# Altium schematic sheet Top.SchDoc: Top Schematic
size A4; Date: Not used; ApprovedBy: Not used; CheckedBy: Not used; Author: Not used; CompanyName: STMicroelectronics; DrawnBy: Not used; Engineer: Not used; Organization: Not used; Address1: Not used; Address2: Not used; Address3: Not used; Address4: Not used; DocumentNumber: Not used; Revision: Not used; SheetNumber: 2; SheetTotal: 6; CurrentTime: Not used; CurrentDate: Not used; Time: Not used; DocumentFullPathAndName: Not used; DocumentName: Not used; ModifiedDate: Not used; ImagePath: Not used; ProjectName: Not used; Application_BuildNumber: Not used
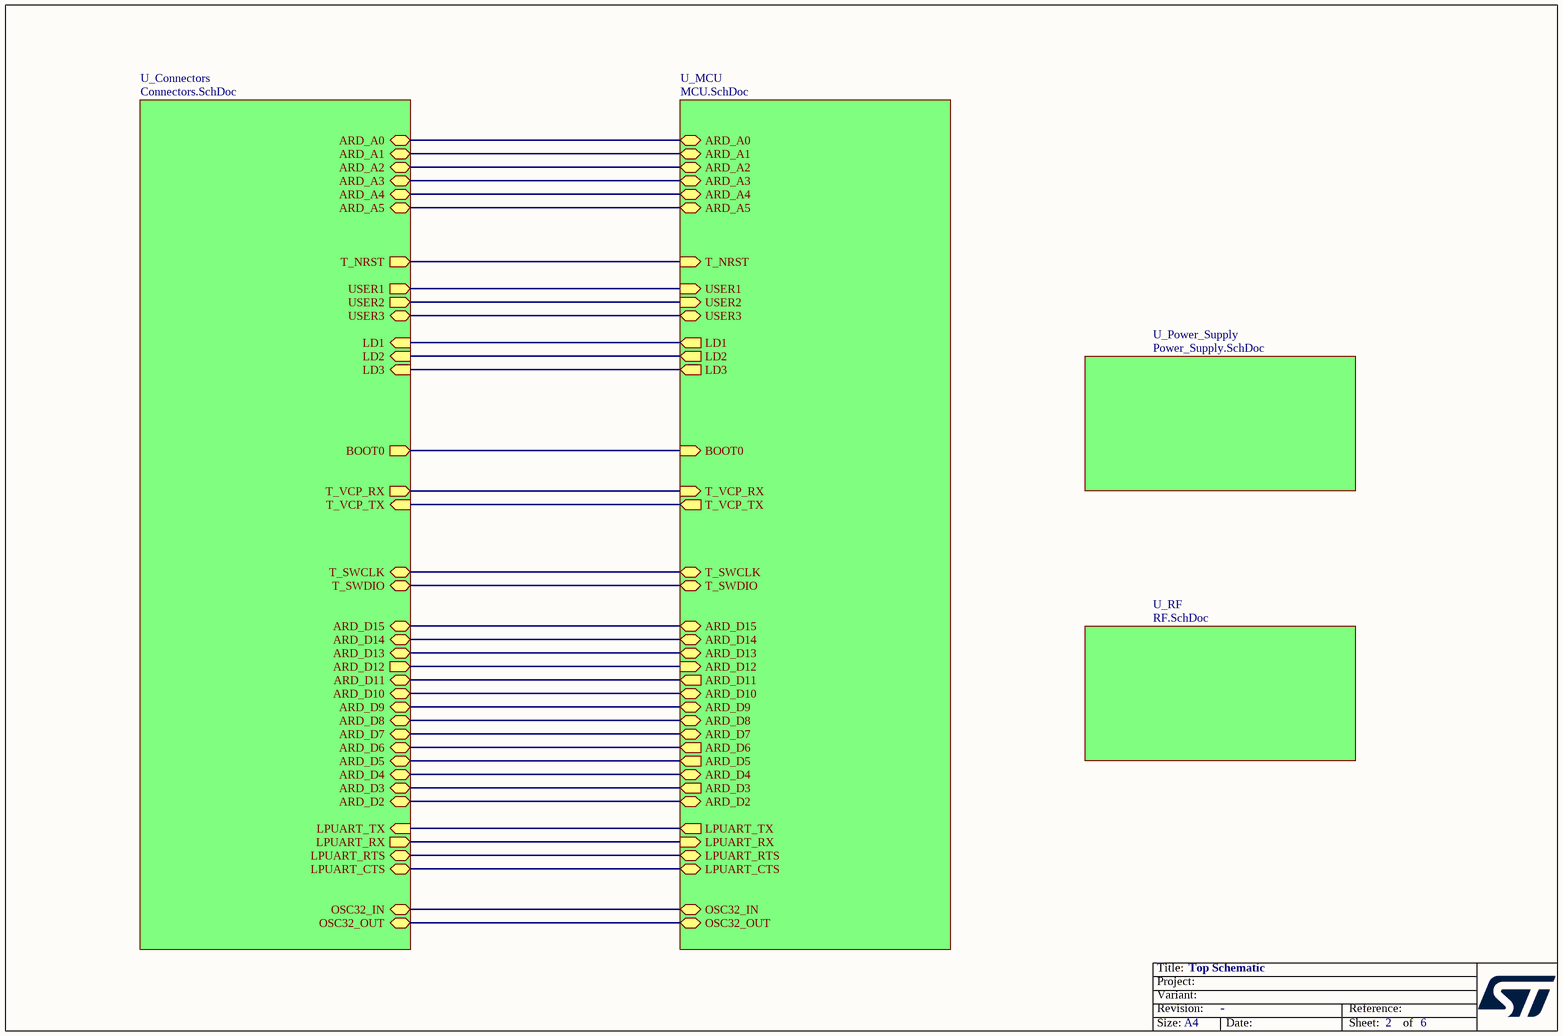
[diagram p0: Top.SchDoc]

## Sub-sheets
U_Connectors = Connectors.SchDoc: LD3 (in), LD1 (in), T_VCP_TX (in), T_SWCLK (bidir), T_SWDIO (bidir), T_VCP_RX (out), T_NRST (out), LD2 (in), OSC32_IN (bidir), OSC32_OUT (bidir), USER2 (out), USER1 (out), BOOT0 (out), ARD_D2 (bidir), USER3 (bidir), ARD_D9 (bidir), ARD_D13 (bidir), ARD_D10 (bidir), ARD_D12 (out), ARD_D14 (bidir), ARD_D15 (bidir), ARD_D11 (bidir), ARD_D8 (bidir), ARD_A1 (bidir), ARD_A0 (bidir), ARD_A2 (bidir), ARD_A3 (bidir), ARD_A4 (bidir), ARD_A5 (bidir), ARD_D7 (bidir), ARD_D6 (bidir), ARD_D3 (bidir), ARD_D4 (bidir), ARD_D5 (bidir), LPUART_TX (in), LPUART_RX (out), LPUART_RTS (bidir), LPUART_CTS (bidir)
U_MCU = MCU.SchDoc: T_NRST (in), LD2 (out), LD3 (out), LD1 (out), T_VCP_RX (in), T_SWCLK (bidir), T_SWDIO (bidir), T_VCP_TX (out), USER2 (in), USER1 (in), OSC32_OUT (bidir), OSC32_IN (bidir), BOOT0 (in), ARD_D2 (bidir), USER3 (bidir), ARD_D9 (bidir), ARD_D14 (bidir), ARD_D15 (bidir), ARD_D8 (bidir), ARD_D12 (in), ARD_D13 (bidir), ARD_A3 (bidir), ARD_A2 (bidir), ARD_A1 (bidir), ARD_A0 (bidir), ARD_A4 (bidir), ARD_A5 (bidir), ARD_D5 (out), ARD_D3 (out), ARD_D6 (out), ARD_D11 (out), ARD_D10 (bidir), ARD_D7 (bidir), ARD_D4 (bidir), LPUART_TX (out), LPUART_RX (in), LPUART_RTS (bidir), LPUART_CTS (bidir)
U_Power_Supply = Power_Supply.SchDoc: no entries
U_RF = RF.SchDoc: no entries

## Nets
(unnamed): sheet U_Connectors/LD3, sheet U_MCU/LD3
(unnamed): sheet U_Connectors/LD1, sheet U_MCU/LD1
(unnamed): sheet U_Connectors/T_VCP_TX, sheet U_MCU/T_VCP_TX
(unnamed): sheet U_Connectors/T_SWCLK, sheet U_MCU/T_SWCLK
(unnamed): sheet U_Connectors/T_SWDIO, sheet U_MCU/T_SWDIO
(unnamed): sheet U_Connectors/T_VCP_RX, sheet U_MCU/T_VCP_RX
(unnamed): sheet U_Connectors/T_NRST, sheet U_MCU/T_NRST
(unnamed): sheet U_Connectors/LD2, sheet U_MCU/LD2
(unnamed): sheet U_Connectors/OSC32_IN, sheet U_MCU/OSC32_IN
(unnamed): sheet U_Connectors/OSC32_OUT, sheet U_MCU/OSC32_OUT
(unnamed): sheet U_Connectors/USER2, sheet U_MCU/USER2
(unnamed): sheet U_Connectors/USER1, sheet U_MCU/USER1
(unnamed): sheet U_Connectors/BOOT0, sheet U_MCU/BOOT0
(unnamed): sheet U_Connectors/ARD_D2, sheet U_MCU/ARD_D2
(unnamed): sheet U_Connectors/USER3, sheet U_MCU/USER3
(unnamed): sheet U_Connectors/ARD_D9, sheet U_MCU/ARD_D9
(unnamed): sheet U_Connectors/ARD_D13, sheet U_MCU/ARD_D13
(unnamed): sheet U_Connectors/ARD_D10, sheet U_MCU/ARD_D10
(unnamed): sheet U_Connectors/ARD_D12, sheet U_MCU/ARD_D12
(unnamed): sheet U_Connectors/ARD_D14, sheet U_MCU/ARD_D14
(unnamed): sheet U_Connectors/ARD_D15, sheet U_MCU/ARD_D15
(unnamed): sheet U_Connectors/ARD_D11, sheet U_MCU/ARD_D11
(unnamed): sheet U_Connectors/ARD_D8, sheet U_MCU/ARD_D8
(unnamed): sheet U_Connectors/ARD_A1, sheet U_MCU/ARD_A1
(unnamed): sheet U_Connectors/ARD_A0, sheet U_MCU/ARD_A0
(unnamed): sheet U_Connectors/ARD_A2, sheet U_MCU/ARD_A2
(unnamed): sheet U_Connectors/ARD_A3, sheet U_MCU/ARD_A3
(unnamed): sheet U_Connectors/ARD_A4, sheet U_MCU/ARD_A4
(unnamed): sheet U_Connectors/ARD_A5, sheet U_MCU/ARD_A5
(unnamed): sheet U_Connectors/ARD_D7, sheet U_MCU/ARD_D7
(unnamed): sheet U_Connectors/ARD_D6, sheet U_MCU/ARD_D6
(unnamed): sheet U_Connectors/ARD_D3, sheet U_MCU/ARD_D3
(unnamed): sheet U_Connectors/ARD_D4, sheet U_MCU/ARD_D4
(unnamed): sheet U_Connectors/ARD_D5, sheet U_MCU/ARD_D5
(unnamed): sheet U_Connectors/LPUART_TX, sheet U_MCU/LPUART_TX
(unnamed): sheet U_Connectors/LPUART_RX, sheet U_MCU/LPUART_RX
(unnamed): sheet U_Connectors/LPUART_RTS, sheet U_MCU/LPUART_RTS
(unnamed): sheet U_Connectors/LPUART_CTS, sheet U_MCU/LPUART_CTS

## Notes on the sheet
- Title:
- Project:
- Size:
- Revision:
- Variant:
- A4
- -
- Date:
- Reference:
- Sheet:
- of